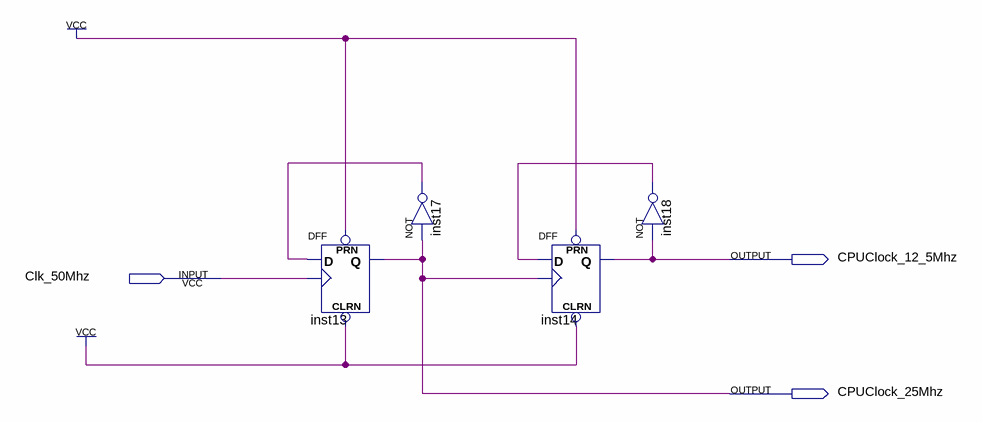
[diagram p0: schematic sheet]
// Quartus schematic Clock_Generator.bdf as structural Verilog: 4 symbols, 3 pins
module Clock_Generator (
  input  Clk_50Mhz,
  output CPUClock_12_5Mhz,
  output CPUClock_25Mhz
);

  wire inst17_out, inst18_out;

  DFF inst13 (.CLRN(1'b1), .CLK(Clk_50Mhz), .D(inst17_out), .PRN(1'b1), .Q(CPUClock_25Mhz));
  not inst17 (inst17_out, CPUClock_25Mhz);
  DFF inst14 (.CLRN(1'b1), .CLK(CPUClock_25Mhz), .D(inst18_out), .PRN(1'b1), .Q(CPUClock_12_5Mhz));
  not inst18 (inst18_out, CPUClock_12_5Mhz);
endmodule
